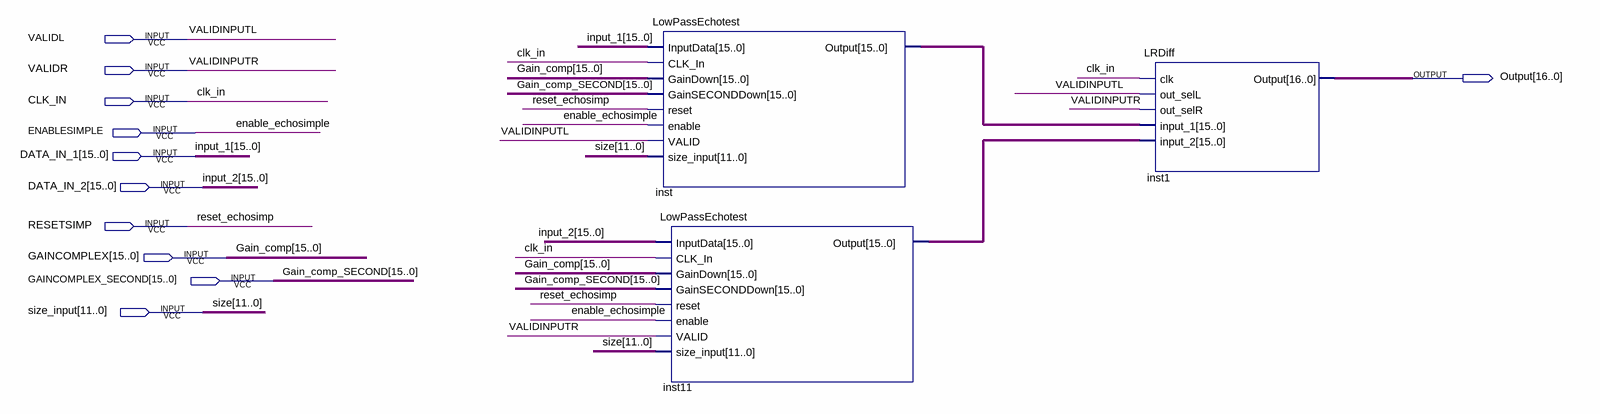
[diagram p0: schematic sheet]
// Quartus schematic CombEchoLowPassBlock.bdf as structural Verilog: 3 symbols, 11 pins
module CombEchoLowPassBlock (
  input  VALIDL,
  input  VALIDR,
  input  CLK_IN,
  input  ENABLESIMPLE,
  input  [15:0] DATA_IN_1,
  input  [15:0] DATA_IN_2,
  input  RESETSIMP,
  input  [15:0] GAINCOMPLEX,
  input  [15:0] GAINCOMPLEX_SECOND,
  input  [11:0] size_input,
  output [16:0] Output
);

  wire [15:0] inst11_output, inst_output;

  LowPassEchotest inst (
    .InputData(DATA_IN_1), .CLK_In(CLK_IN), .GainDown(GAINCOMPLEX), .GainSECONDDown(GAINCOMPLEX_SECOND),
    .reset(RESETSIMP), .enable(ENABLESIMPLE), .VALID(VALIDL), .size_input(size_input), .Output(inst_output));
  LowPassEchotest inst11 (
    .InputData(DATA_IN_2), .CLK_In(CLK_IN), .GainDown(GAINCOMPLEX), .GainSECONDDown(GAINCOMPLEX_SECOND),
    .reset(RESETSIMP), .enable(ENABLESIMPLE), .VALID(VALIDR), .size_input(size_input), .Output(inst11_output));
  LRDiff inst1 (
    .clk(CLK_IN), .out_selL(VALIDL), .out_selR(VALIDR), .input_1(inst_output), .input_2(inst11_output),
    .Output(Output));

  // Other names for the same wires on the sheet: enable_echosimple = ENABLESIMPLE; Gain_comp[15:0] = GAINCOMPLEX;
  //   Gain_comp_SECOND[15:0] = GAINCOMPLEX_SECOND; input_1[15:0] = DATA_IN_1; input_2[15:0] = DATA_IN_2;
  //   reset_echosimp = RESETSIMP; size[11:0] = size_input; VALIDINPUTL = VALIDL; VALIDINPUTR = VALIDR
endmodule
